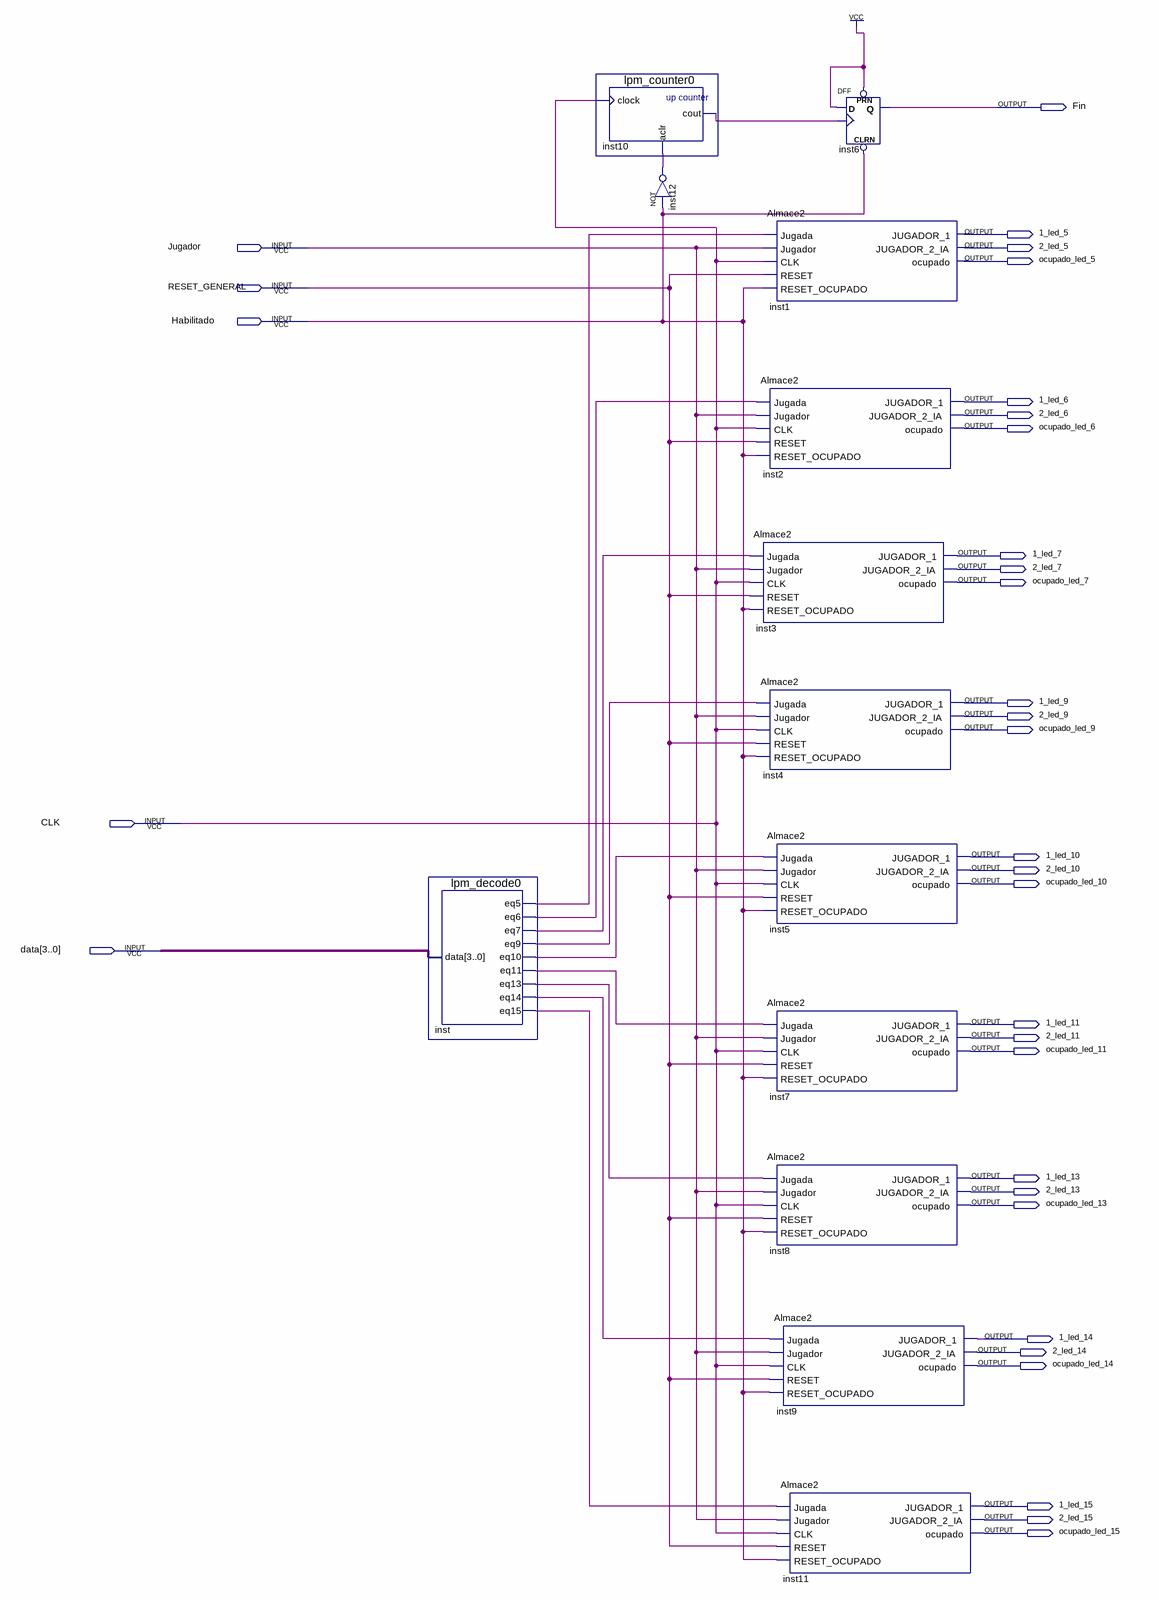
[diagram p0: schematic sheet]
// Quartus schematic jugadas_full.bdf as structural Verilog: 13 symbols, 33 pins
module jugadas_full (
  input  Jugador,
  input  RESET_GENERAL,
  input  Habilitado,
  input  CLK,
  input  [3:0] data,
  output Fin,
  output \1_led_5 ,
  output \2_led_5 ,
  output ocupado_led_5,
  output \1_led_6 ,
  output \2_led_6 ,
  output ocupado_led_6,
  output \1_led_7 ,
  output \2_led_7 ,
  output ocupado_led_7,
  output \1_led_9 ,
  output \2_led_9 ,
  output ocupado_led_9,
  output \1_led_10 ,
  output \2_led_10 ,
  output ocupado_led_10,
  output \1_led_11 ,
  output \2_led_11 ,
  output ocupado_led_11,
  output \1_led_13 ,
  output \2_led_13 ,
  output ocupado_led_13,
  output \1_led_14 ,
  output \2_led_14 ,
  output ocupado_led_14,
  output \1_led_15 ,
  output \2_led_15 ,
  output ocupado_led_15
);

  wire inst10_cout, inst12_out, inst_eq5, inst_eq6, inst_eq7, inst_eq9, inst_eq10, inst_eq11, inst_eq13,
       inst_eq14, inst_eq15;

  lpm_decode0 inst (
    .data(data), .eq5(inst_eq5), .eq6(inst_eq6), .eq7(inst_eq7), .eq9(inst_eq9), .eq10(inst_eq10),
    .eq11(inst_eq11), .eq13(inst_eq13), .eq14(inst_eq14), .eq15(inst_eq15));
  lpm_counter0 inst10 (.clock(CLK), .aclr(inst12_out), .cout(inst10_cout));
  not inst12 (inst12_out, Habilitado);
  Almace2 inst1 (
    .Jugada(inst_eq5), .Jugador(Jugador), .CLK(CLK), .RESET(RESET_GENERAL), .RESET_OCUPADO(Habilitado),
    .JUGADOR_1(\1_led_5 ), .JUGADOR_2_IA(\2_led_5 ), .ocupado(ocupado_led_5));
  Almace2 inst2 (
    .Jugada(inst_eq6), .Jugador(Jugador), .CLK(CLK), .RESET(RESET_GENERAL), .RESET_OCUPADO(Habilitado),
    .JUGADOR_1(\1_led_6 ), .JUGADOR_2_IA(\2_led_6 ), .ocupado(ocupado_led_6));
  Almace2 inst3 (
    .Jugada(inst_eq7), .Jugador(Jugador), .CLK(CLK), .RESET(RESET_GENERAL), .RESET_OCUPADO(Habilitado),
    .JUGADOR_1(\1_led_7 ), .JUGADOR_2_IA(\2_led_7 ), .ocupado(ocupado_led_7));
  Almace2 inst4 (
    .Jugada(inst_eq9), .Jugador(Jugador), .CLK(CLK), .RESET(RESET_GENERAL), .RESET_OCUPADO(Habilitado),
    .JUGADOR_1(\1_led_9 ), .JUGADOR_2_IA(\2_led_9 ), .ocupado(ocupado_led_9));
  Almace2 inst5 (
    .Jugada(inst_eq10), .Jugador(Jugador), .CLK(CLK), .RESET(RESET_GENERAL), .RESET_OCUPADO(Habilitado),
    .JUGADOR_1(\1_led_10 ), .JUGADOR_2_IA(\2_led_10 ), .ocupado(ocupado_led_10));
  Almace2 inst7 (
    .Jugada(inst_eq11), .Jugador(Jugador), .CLK(CLK), .RESET(RESET_GENERAL), .RESET_OCUPADO(Habilitado),
    .JUGADOR_1(\1_led_11 ), .JUGADOR_2_IA(\2_led_11 ), .ocupado(ocupado_led_11));
  Almace2 inst8 (
    .Jugada(inst_eq13), .Jugador(Jugador), .CLK(CLK), .RESET(RESET_GENERAL), .RESET_OCUPADO(Habilitado),
    .JUGADOR_1(\1_led_13 ), .JUGADOR_2_IA(\2_led_13 ), .ocupado(ocupado_led_13));
  Almace2 inst9 (
    .Jugada(inst_eq14), .Jugador(Jugador), .CLK(CLK), .RESET(RESET_GENERAL), .RESET_OCUPADO(Habilitado),
    .JUGADOR_1(\1_led_14 ), .JUGADOR_2_IA(\2_led_14 ), .ocupado(ocupado_led_14));
  Almace2 inst11 (
    .Jugada(inst_eq15), .Jugador(Jugador), .CLK(CLK), .RESET(RESET_GENERAL), .RESET_OCUPADO(Habilitado),
    .JUGADOR_1(\1_led_15 ), .JUGADOR_2_IA(\2_led_15 ), .ocupado(ocupado_led_15));
  DFF inst6 (.CLRN(Habilitado), .CLK(inst10_cout), .D(1'b1), .PRN(1'b1), .Q(Fin));
endmodule
